# Altium schematic sheet Ethernet.SchDoc
size A3
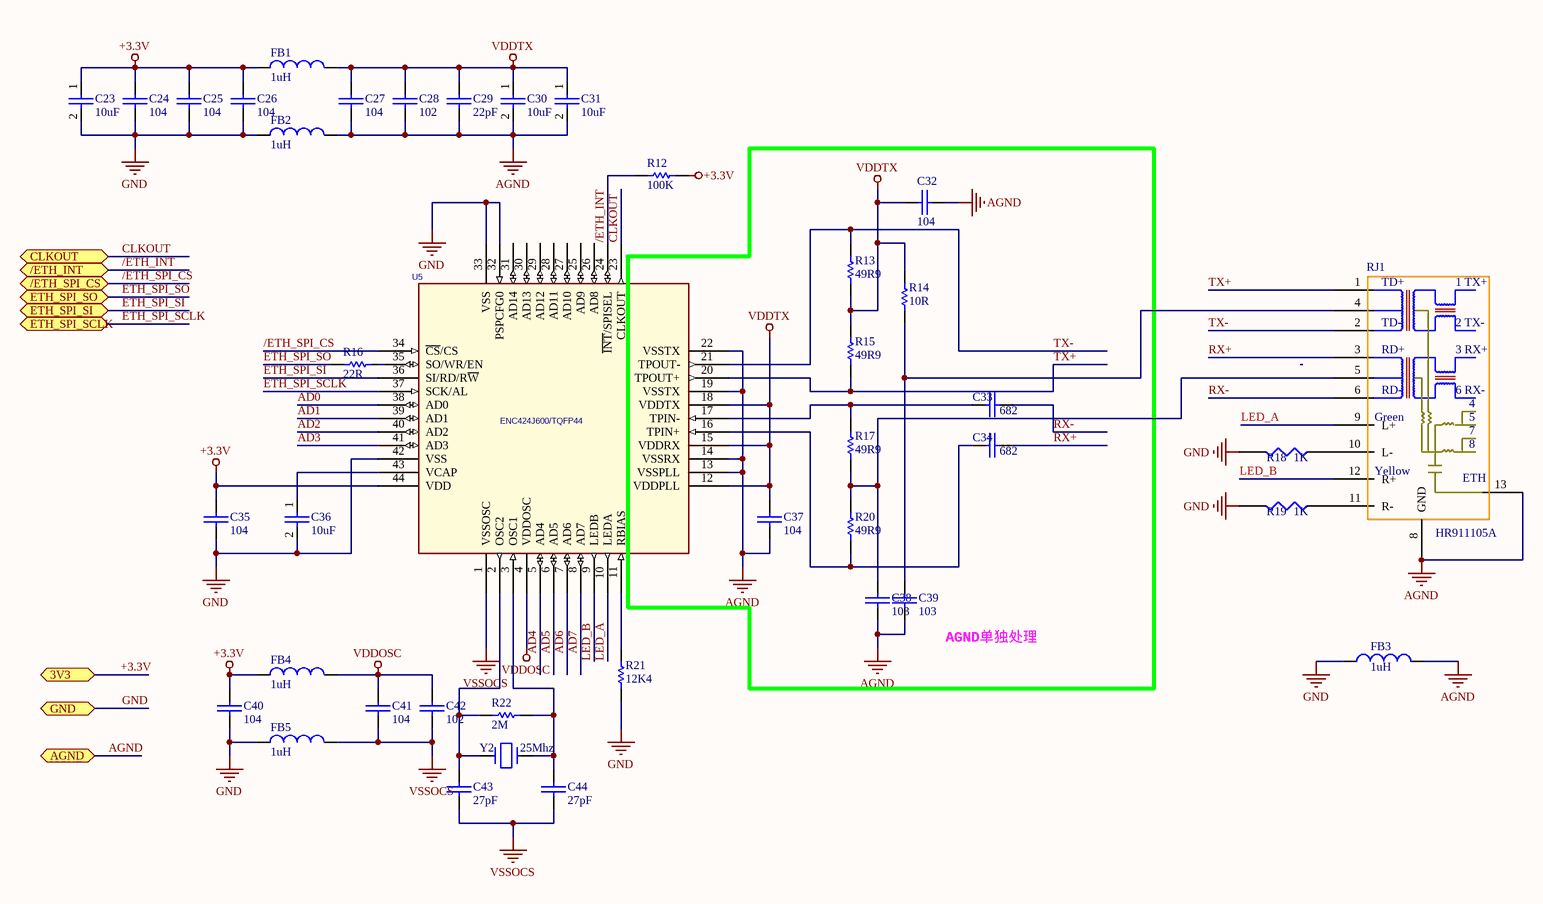
[diagram p0: Ethernet.SchDoc]

## Parts
C23  10uF  [0805]
C24  104  [0603C]
C25  104  [0603C]
C26  104  [0603C]
C27  104  [0603C]
C28  102  [0603C]
C29  22pF  [0603C]
C30  10uF  [0805]
C31  10uF  [0805]
C32  104  [0603C]
C33  682  [0603C]
C34  682  [0603C]
C35  104  [0603C]
C36  10uF  [0805]
C37  104  [0603C]
C38  103  [0603C]
C39  103  [0603C]
C40  104  [0603C]
C41  104  [0603C]
C42  102  [0603C]
C43  27pF  [0603C]
C44  27pF  [0603C]
FB1  1uH  [0603R]
FB2  1uH  [0603R]
FB3  1uH  [0805]
FB4  1uH  [0603R]
FB5  1uH  [0603R]
R12  100K  [0603R]
R13  49R9  [0603R]
R14  10R  [0603R]
R15  49R9  [0603R]
R16  22R  [0603R]
R17  49R9  [0603R]
R18  1K  [0603C]
R19  1K  [0603C]
R20  49R9  [0603R]
R21  12K4  [0603R]
R22  2M  [0603R]
RJ1  HR911105A  [HR911105A]
U5  ENC424J600/TQFP44  [TQFP44]
Y2  25Mhz  [XTAL]

## Blocks framed on the sheet
AGND单独处理: C32-C34 C37-C39 R13-R15 R17 R20

## Ports
3V3, /ETH_INT, /ETH_SPI_CS, AGND, CLKOUT, ETH_SPI_SCLK, ETH_SPI_SI, ETH_SPI_SO, GND

## Nets
+3.3V: C23.1 C24.2 C25.2 C26.2 C35.2 C40.2 FB1.1 FB4.1 R12.2 U5.44(VDD) ; port 3V3
AGND: C27.1 C28.1 C29.1 C30.2 C31.2 C32.1 C37.1 C38.1 C39.1 FB2.2 FB3.2 RJ1.8(GND) RJ1.13 U5.13(VSSPLL) U5.14(VSSRX) U5.19(VSSTX) U5.22(VSSTX) ; port AGND
GND: C23.2 C24.1 C25.1 C26.1 C35.1 C36.2 C40.1 FB2.1 FB3.1 FB5.1 R18.2 R19.2 R21.2 U5.32(PSPCFG0) U5.33(VSS) U5.42(VSS) ; port GND
VDDOSC: C41.2 C42.2 FB4.2 U5.4(VDDOSC)
VDDTX: C27.2 C28.2 C29.2 C30.1 C31.1 C32.2 C37.2 FB1.2 R13.1 R14.2 R15.2 U5.12(VDDPLL) U5.15(VDDRX) U5.18(VDDTX)
VSSOCS: C41.1 C42.1 C43.1 C44.1 FB5.2 U5.1(VSSOSC)
/ETH_INT: R12.1 U5.24(~{INT}/SPISEL) ; port /ETH_INT
/ETH_SPI_CS: U5.34(~{CS}/CS) ; port /ETH_SPI_CS
AD0: U5.38(AD0)
AD1: U5.39(AD1)
AD2: U5.40(AD2)
AD3: U5.41(AD3)
AD4: U5.5(AD4)
AD5: U5.6(AD5)
AD6: U5.7(AD6)
AD7: U5.8(AD7)
CLKOUT: U5.23(CLKOUT) ; port CLKOUT
ETH_SPI_SCLK: U5.37(SCK/AL) ; port ETH_SPI_SCLK
ETH_SPI_SI: U5.36(SI/RD/R~{W}) ; port ETH_SPI_SI
ETH_SPI_SO: R16.1 ; port ETH_SPI_SO
LED_A: RJ1.9(L+) U5.10(LEDA)
LED_B: RJ1.12(R+) U5.9(LEDB)
RX+: C34.1 RJ1.3
RX-: C33.1 RJ1.6
TX+: R15.1 RJ1.1 U5.20(TPOUT+)
TX-: R13.2 RJ1.2 U5.21(TPOUT-)
NetC33_2: C33.2 R17.2 U5.17(TPIN-)
NetC34_2: C34.2 R20.1 U5.16(TPIN+)
NetC36_1: C36.1 U5.43(VCAP)
NetC38_2: C38.2 R17.1 R20.2 RJ1.5
NetC39_2: C39.2 R14.1 RJ1.4
NetC43_2: C43.2 R22.2 U5.2(OSC2) Y2.2
NetC44_2: C44.2 R22.1 U5.3(OSC1) Y2.1
NetR16_2: R16.2 U5.35(SO/WR/EN)
NetR18_1: R18.1 RJ1.10(L-)
NetR19_1: R19.1 RJ1.11(R-)
NetR21_1: R21.1 U5.11(RBIAS)

Not connected (* = marked no-connect by the designer): U5 25(AD9) 26(AD8) 27(AD10) 28(AD11) 29(AD12) 30(AD13) 31(AD14)

## Notes on the sheet
- (in symbol HR911105A) TD+; 1 TX+; TD-; 2 TX-; RD+; 3 RX+; RD-; 6 RX-; Green; 7; Yellow; ETH

## Library data of the parts
C23-C44 = CAP: Capacitor
FB1-FB5 = Inductor: Value: 100uH; Published: 8-Jun-2000; Revision: July-2002: Re-released for DXP Platform.; Publisher: Altium Limited
R12-R17 R20-R22 = res1: Resistor; Value: 1K; Published: 8-Jun-2000; Revision: July-2002: Re-released for DXP Platform.; Publisher: Altium Limited
R18 R19 = RES1
Y2 = CRYSTAL: Part Field 1: 1; Part Field 5: 1; Part Field 6: 1000K